# Altium schematic sheet moterdriver.SchDoc
size A4; SheetNumber: 5; SheetTotal: 5
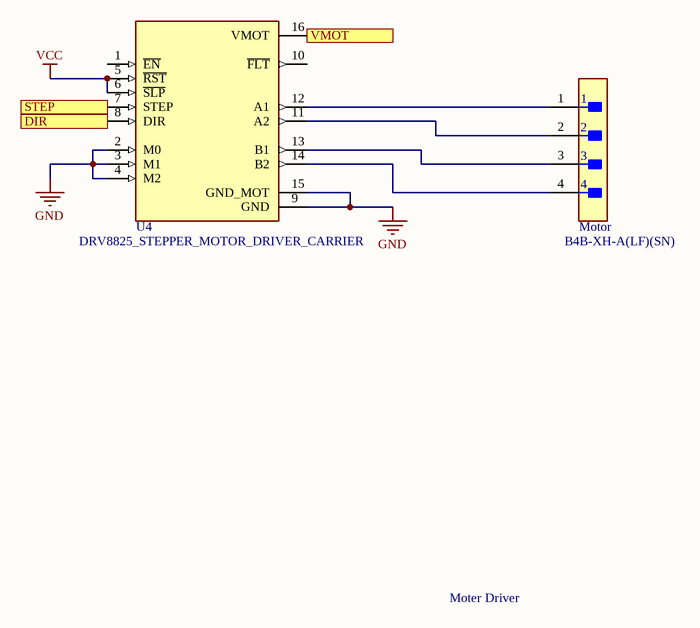
[diagram p0: moterdriver.SchDoc]

## Parts
Motor  B4B-XH-A(LF)(SN)  [FP-B4B-XH-A_LF_SN-MFG]
U4  DRV8825_STEPPER_MOTOR_DRIVER_CARRIER  [IC_DRV8825_STEPPER_MOTOR_DRIVER_CARRIER]

## Ports
DIR (in), STEP (in), VMOT

## Nets
GND: U4.2(M0) U4.3(M1) U4.4(M2) U4.9(GND) U4.15(GND_MOT)
VCC: U4.5(~{RST}) U4.6(~{SLP})
DIR: U4.8(DIR) ; port DIR
STEP: U4.7(STEP) ; port STEP
VMOT: U4.16(VMOT) ; port VMOT
NetMotor_1: Motor.1 U4.12(A1)
NetMotor_2: Motor.2 U4.11(A2)
NetMotor_3: Motor.3 U4.13(B1)
NetMotor_4: Motor.4 U4.14(B2)

Not connected (* = marked no-connect by the designer): U4 1(~{EN}) 10(~{FLT})

## Notes on the sheet
- Moter Driver

## Library data of the parts
Motor = CMP-17439-000250-1: CONN HEADER VERT 4POS 2.5MM; Number of Contacts: 4; Contact Resistance: 20mR; Voltage Rating: 250V; Max Current Rating: 3A; Gender: Male; Wire/Cable Gauge: 22AWG; Mated Stacking Heights: 9.8mm; Insulation Resistance: 1GR; Orientation: Straight; Contact Type: Male Pin; Contact Finish - Mating: TIN; Series: XH; Max Voltage Rating (AC): 250V; Lead Pitch: 2.5mm; Contact Shape: Square; Insulation Color: Natural; Termination: Solder; Lead Free: Lead Free; Voltage Rating (AC): 250V; Number of Rows: 1; Flammability Rating: UL94 V-0; Number of Positions: 4; Max Operating Temperature: 85°C; Package Quantity: 500; Mount: Through Hole; REACH SVHC: No SVHC; Connector Type: Header; Insulation Material: Nylon; Fastening Type: Detent; Min Operating Temperature: -25°C; Housing Color: White; Packaging: Bulk; Contact Plating: Tin; Contact Material: Brass; Max Voltage Rating (DC): 250V; Housing Material: Polyamide; Color: Natural; Material: Polyamide; Pitch: 2.5mm; Depth: 5.75mm; Current Rating: 3A; Length: 12.4mm
U4 = DRV8825_STEPPER_MOTOR_DRIVER_CARRIER: Stepper motor controler; IC: DRV8825; 1.5A; Uin mot: 8.2Ã·45V; Availability: Unavailable; MP: DRV8825_STEPPER_MOTOR_DRIVER_CARRIER; Value: *; Price: None; Package: None